# EAGLE design Duino232 (EAGLE 4.16)
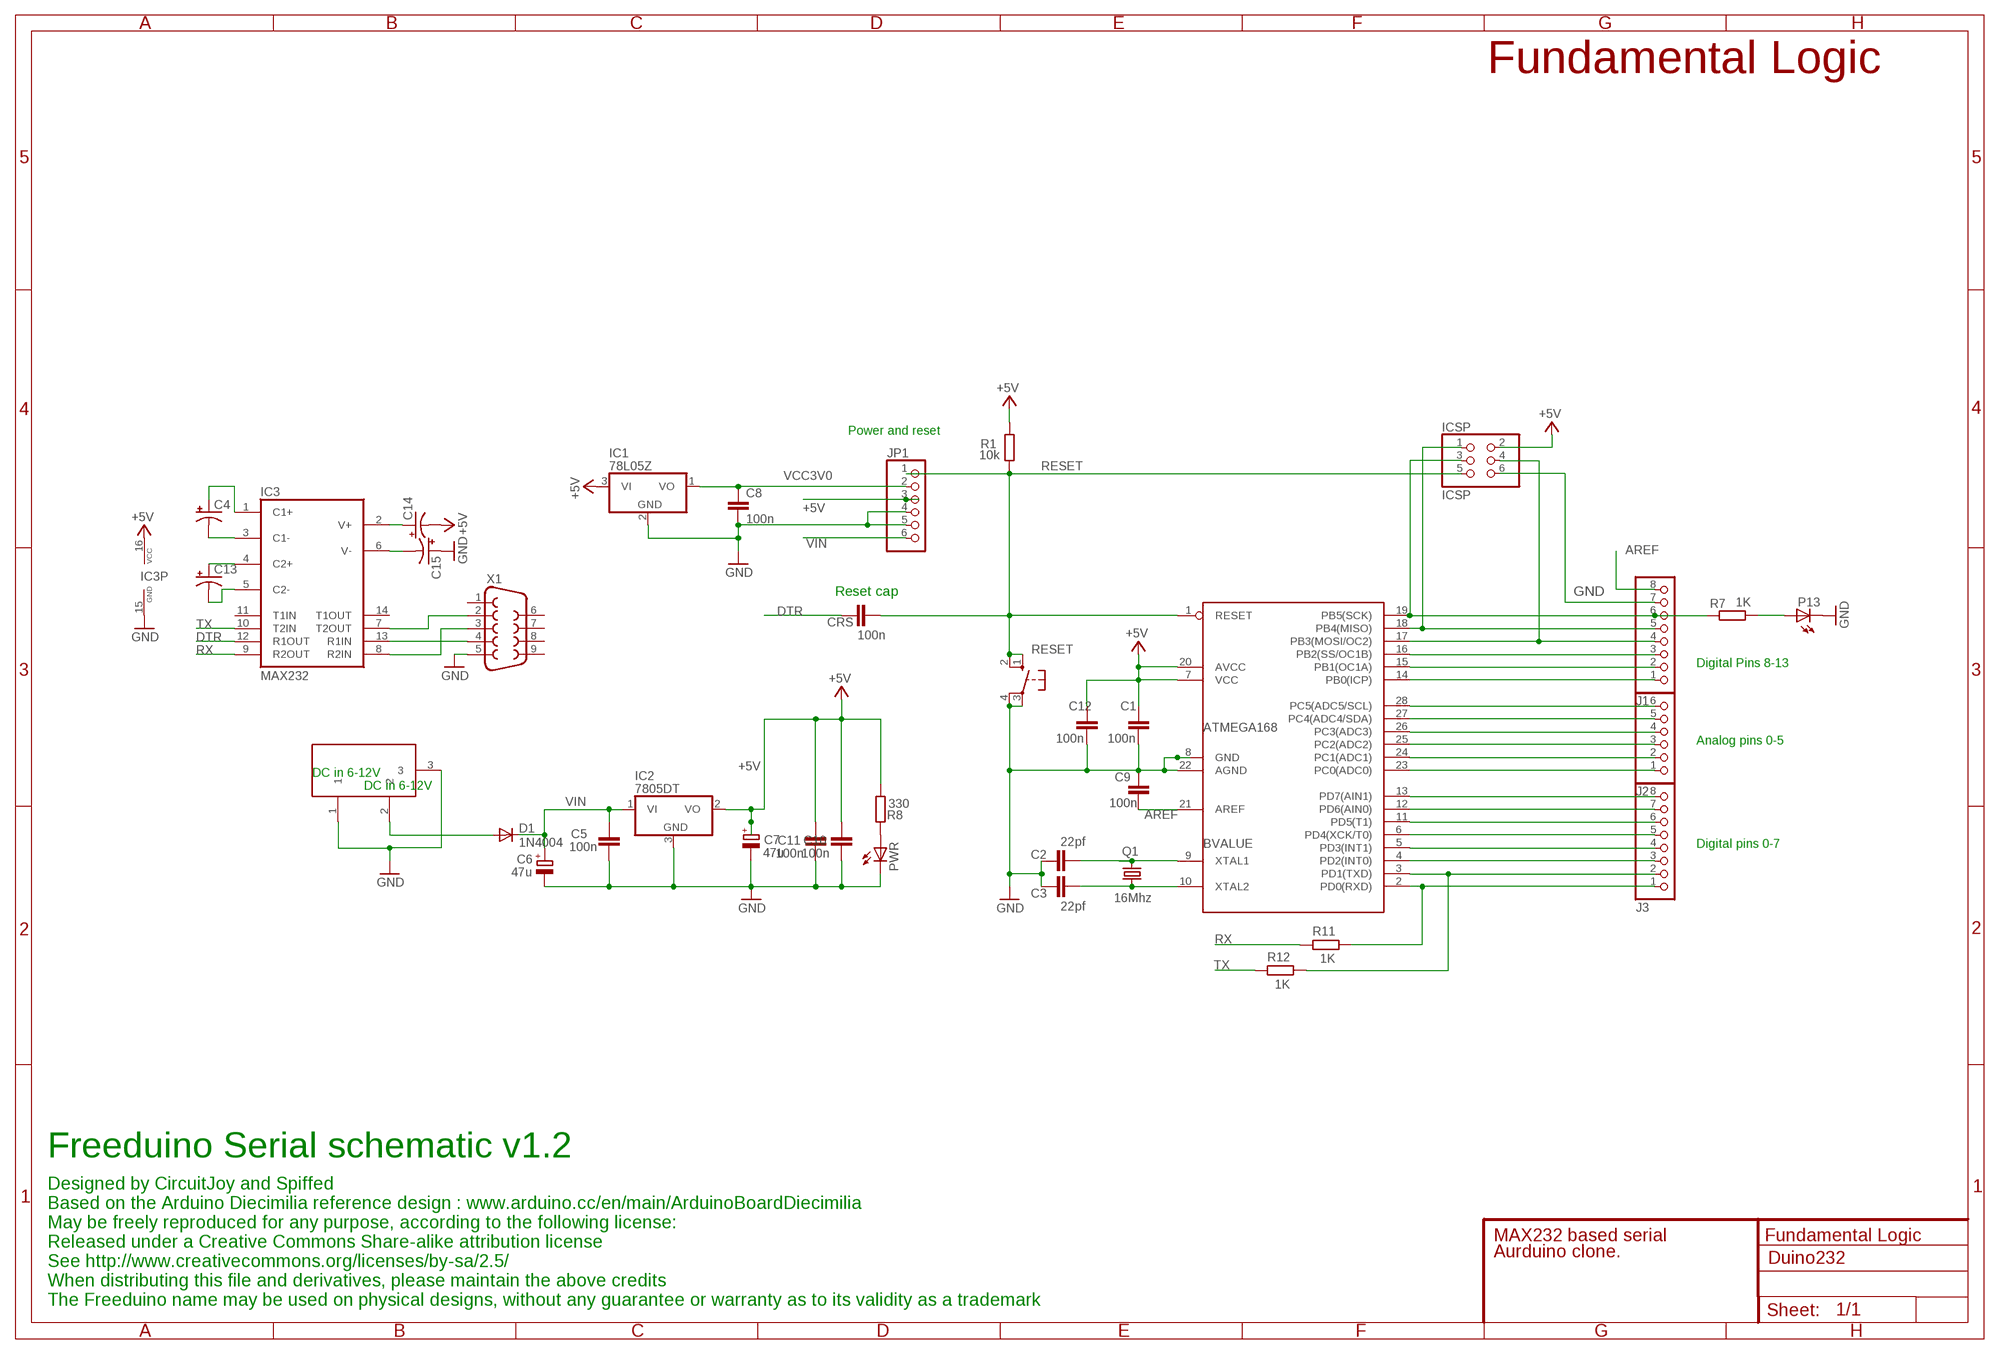
[diagram p0: schematic, sheet 1]

## Parts
BVALUE  ATMEGA168  MEGA8-P  [DIL28-3]
C1  100n  C-EU050-024X044  [C050-024X044]
C2  22pf  C-EU025-024X044  [C025-024X044]
C3  22pf  C-EU025-024X044  [C025-024X044]
C4  CPOL-USE1.8-4  [E1,8-4]
C5  100n  C-EU050-024X044  [C050-024X044]
C6  47u  CPOL-EUE3.5-8  [E3,5-8]
C7  47u  CPOL-EUE3.5-8  [E3,5-8]
C8  100n  C-EU050-024X044  [C050-024X044]
C9  100n  C-EU050-024X044  [C050-024X044]
C10  100n  C-EU050-024X044  [C050-024X044]
C11  100n  C-EUC1206  [C1206]
C12  100n  C-EU050-024X044  [C050-024X044]
C13  CPOL-USE1.8-4  [E1,8-4]
C14  CPOL-USE1.8-4  [E1,8-4]
C15  CPOL-USE1.8-4  [E1,8-4]
CRS  100n  C-EU050-024X044  [C050-024X044]
D1  1N4004  [DO41-10]
DC1  9V in  DC21MMX  [DC-21MM]
IC1  78L05Z  [TO92]
IC2  7805DT  [TO252]
IC3  MAX232  [DIL16]
ICSP  ICSP  PINHD-2X3  [2X03]
J1  PINHD-1X8  [1X08]
J2  PINHD-1X6  [1X06]
J3  PINHD-1X8  [1X08]
JP1  PINHD-1X6  [1X06]
P13  LED3MM  [LED3MM]
PWR  LED3MM  [LED3MM]
Q1  16Mhz  CRYSTALHC49U-V  [HC49U-V]
R1  10k  R-EU_0204/7  [0204/7]
R7  1K  R-EU_0204/7  [0204/7]
R8  330  R-EU_0204/7  [0204/7]
R11  1K  R-EU_0204/7  [0204/7]
R12  1K  R-EU_0204/7  [0204/7]
RESET  10-XX  [B3F-10XX]
X1  F09HP  [F09HP]

## Nets
+5V [power]: BVALUE.7(VCC) BVALUE.20(AVCC) C1.1 C7.+ C10.2 C11.2 C12.1 C14.- IC1.3(VI) IC2.2(VO) IC3.16(VCC) ICSP.2 JP1.3 R1.2 R8.1
AREF: BVALUE.21(AREF) C9.1 J1.8
DTR: CRS.1 IC3.12(R1OUT)
GND [power]: BVALUE.8(GND) BVALUE.22(AGND) C1.2 C2.1 C3.1 C5.1 C6.- C7.- C8.2 C9.2 C10.1 C11.1 C12.2 C15.+ DC1.1 DC1.3 IC1.2(GND) IC2.3(GND) IC3.15(GND) ICSP.6 J1.7 JP1.4 JP1.5 P13.K(C) PWR.K(C) RESET.3(P) RESET.4(P1) X1.5
N$2: BVALUE.15(PB1(OC1A)) J1.2
N$3: PWR.A R8.2
N$6: BVALUE.9(XTAL1) C2.2 Q1.2
N$7: C14.+ IC3.2(V+)
N$8 [power]: D1.A DC1.2
N$9: C15.- IC3.6(V-)
N$10: BVALUE.4(PD2(INT0)) J3.3
N$11: BVALUE.5(PD3(INT1)) J3.4
N$12: BVALUE.6(PD4(XCK/T0)) J3.5
N$13: BVALUE.11(PD5(T1)) J3.6
N$14: BVALUE.12(PD6(AIN0)) J3.7
N$15: BVALUE.13(PD7(AIN1)) J3.8
N$16: BVALUE.23(PC0(ADC0)) J2.1
N$17: BVALUE.24(PC1(ADC1)) J2.2
N$18: BVALUE.25(PC2(ADC2)) J2.3
N$19: BVALUE.26(PC3(ADC3)) J2.4
N$20: BVALUE.27(PC4(ADC4/SDA)) J2.5
N$21: BVALUE.28(PC5(ADC5/SCL)) J2.6
N$22: BVALUE.3(PD1(TXD)) J3.2 R12.2
N$23: BVALUE.16(PB2(SS/OC1B)) J1.3
N$24: C4.- IC3.3(C1-)
N$26: BVALUE.18(PB4(MISO)) ICSP.1 J1.5
N$27: C4.+ IC3.1(C1+)
N$28: BVALUE.14(PB0(ICP)) J1.1
N$31: BVALUE.10(XTAL2) C3.2 Q1.1
N$32: P13.A R7.1
N$35: C13.+ IC3.4(C2+)
N$38: C13.- IC3.5(C2-)
N$39: IC3.7(T2OUT) X1.2
N$40: IC3.8(R2IN) X1.3
N$41: IC3.13(R1IN) X1.4
N$43: BVALUE.17(PB3(MOSI/OC2)) ICSP.4 J1.4
N$44: BVALUE.2(PD0(RXD)) J3.1 R11.2
RESET: BVALUE.1(RESET) CRS.2 ICSP.5 JP1.1 R1.1 RESET.1(S) RESET.2(S1)
RX: IC3.9(R2OUT) R11.1
SCK: BVALUE.19(PB5(SCK)) ICSP.3 J1.6 R7.2
TX: IC3.10(T2IN) R12.1
VCC3V0 [power]: C8.1 IC1.1(VO) JP1.2
VIN [power]: C5.2 C6.+ D1.C IC2.1(VI) JP1.6
Unconnected: IC3.11(T1IN) IC3.14(T1OUT) X1.1 X1.6 X1.7 X1.8 X1.9

## Notes on the sheet
- Fundamental Logic
- Power and reset
- Reset cap
- Digital Pins 8-13
- Analog pins 0-5
- DC in 6-12V
- DC in 6-12V
- Digital pins 0-7
- Freeduino Serial schematic v1.2
- Designed by CircuitJoy and Spiffed
- Based on the Arduino Diecimilia reference design : www.arduino.cc/en/main/ArduinoBoardDiecimilia
- May be freely reproduced for any purpose, according to the following license:
- MAX232 based serial | Fundamental Logic
- Released under a Creative Commons Share-alike attribution license
- Aurduino clone.
- See http://www.creativecommons.org/licenses/by-sa/2.5/
- When distributing this file and derivatives, please maintain the above credits
- The Freeduino name may be used on physical designs, without any guarantee or warranty as to its validity as a trademark

## Library data of the parts
BVALUE = my-library:MEGA8-P: MICROCONTROLLER 8 Kbytes FLASH 1 kbytes SRAM 512 bytes EEPROM USART 4-channel 10 bit ADC 2-channel 8 bit ADC Source: avr.lbr
C1-C3 C5 C8-C12 CRS = rcl:C-EU: CAPACITOR, European symbol
C4 C13-C15 = rcl:CPOL-US: POLARIZED CAPACITOR, American symbol
C6 C7 = rcl:CPOL-EU: POLARIZED CAPACITOR, European symbol
D1 = diode:1N4004: DIODE general purpose rectifier, 1 A
DC1 = powersupply:DC21MM
IC1 = linear:78*: Positive VOLTAGE REGULATOR Source: http://cache.national.com/ds/LM/LM78L05.pdf http://www.fairchildsemi.com/ds/LM/LM7805.pdf
IC2 = spiffie-org:78*: Positive VOLTAGE REGULATOR Source: http://cache.national.com/ds/LM/LM78L05.pdf http://www.fairchildsemi.com/ds/LM/LM7805.pdf
IC3 = maxim:MAX232: RS232 TRANSEIVER
ICSP = pinhead:PINHD-2X3: PIN HEADER
J1 J3 = pinhead:PINHD-1X8: PIN HEADER
J2 JP1 = pinhead:PINHD-1X6: PIN HEADER
P13 PWR = led:LED: LED OSRAM: - CHIPLED LG R971, LG N971, LY N971, LG Q971, LY Q971, LO R971, LY R971 LH N974, LH R974 LS Q976, LO Q976, LY Q976 LO Q996 - Hyper CHIPLED LW Q18S LB Q993, LB Q99A, LB R99A - SideLED LS A670, LO A670, LY A670, LG A670, LP A670 LB A673, LV A673, LT A673, LW A673 LH A674 LY A675 LS A676, LA A676, LO A676, LY A676, LW A676 LS A679, LY A679, LG A679 - Hyper Micro SIDELED® LS Y876, LA Y876, LO Y876, LY Y876 LT Y87S - SmartLED LW L88C, LW L88S LB L89C, LB L89S, LG L890 LS L89K, LO L89K, LY L89K LS L896, LA L896, LO L896, LY L896 - TOPLED LS T670, LO T670, LY T670, LG T670, LP T670 LSG T670, LSP T670, LSY T670, LOP T670, LYG T670 LG T671, LOG T671, LSG T671 LB T673, LV T673, LT T673, LW T673 LH T674 LS T676, LA T676, LO T676, LY T676, LB T676, LH T676, LSB T676, LW T676 LB T67C, LV T67C, LT T67C, LS T67K, LO T67K, LY T67K, LW E67C LS E67B, LA E67B, LO E67B, LY E67B, LB E67C, LV E67C, LT E67C LW T67C LS T679, LY T679, LG T679 LS T770, LO T770, LY T770, LG T770, LP T770 LB T773, LV T773, LT T773, LW T773 LH T774 LS E675, LA E675, LY E675, LS T675 LS T776, LA T776, LO T776, LY T776, LB T776 LHGB T686 LT T68C, LB T68C - Hyper Mini TOPLED® LB M676 - Mini TOPLED Santana® LG M470 LS M47K, LO M47K, LY M47K Source: http://www.osram.convergy.de - LUMILED® LXK2-PW12-R00, LXK2-PW12-S00, LXK2-PW14-U00, LXK2-PW14-V00 LXK2-PM12-R00, LXK2-PM12-S00, LXK2-PM14-U00 LXK2-PE12-Q00, LXK2-PE12-R00, LXK2-PE12-S00, LXK2-PE14-T00, LXK2-PE14-U00 LXK2-PB12-K00, LXK2-PB12-L00, LXK2-PB12-M00, LXK2-PB14-N00, LXK2-PB14-P00, LXK2-PB14-Q00 LXK2-PR12-L00, LXK2-PR12-M00, LXK2-PR14-Q00, LXK2-PR14-R00 LXK2-PD12-Q00, LXK2-PD12-R00, LXK2-PD12-S00 LXK2-PH12-R00, LXK2-PH12-S00 LXK2-PL12-P00, LXK2-PL12-Q00, LXK2-PL12-R00 Source: www.luxeon.com
Q1 = crystal:CRYSTAL: CRYSTAL
R1 R7 R8 R11 R12 = rcl:R-EU_: RESISTOR, European symbol
RESET = switch-omron:10-XX: OMRON SWITCH
X1 = con-subd:F09: SUB-D

## Net classes
0 default: width 0.203 mm, drill 0.203 mm
1 power: width 0.406 mm, drill 0.203 mm
2 finepitch: width 0.203 mm, drill 0.203 mm

## Board
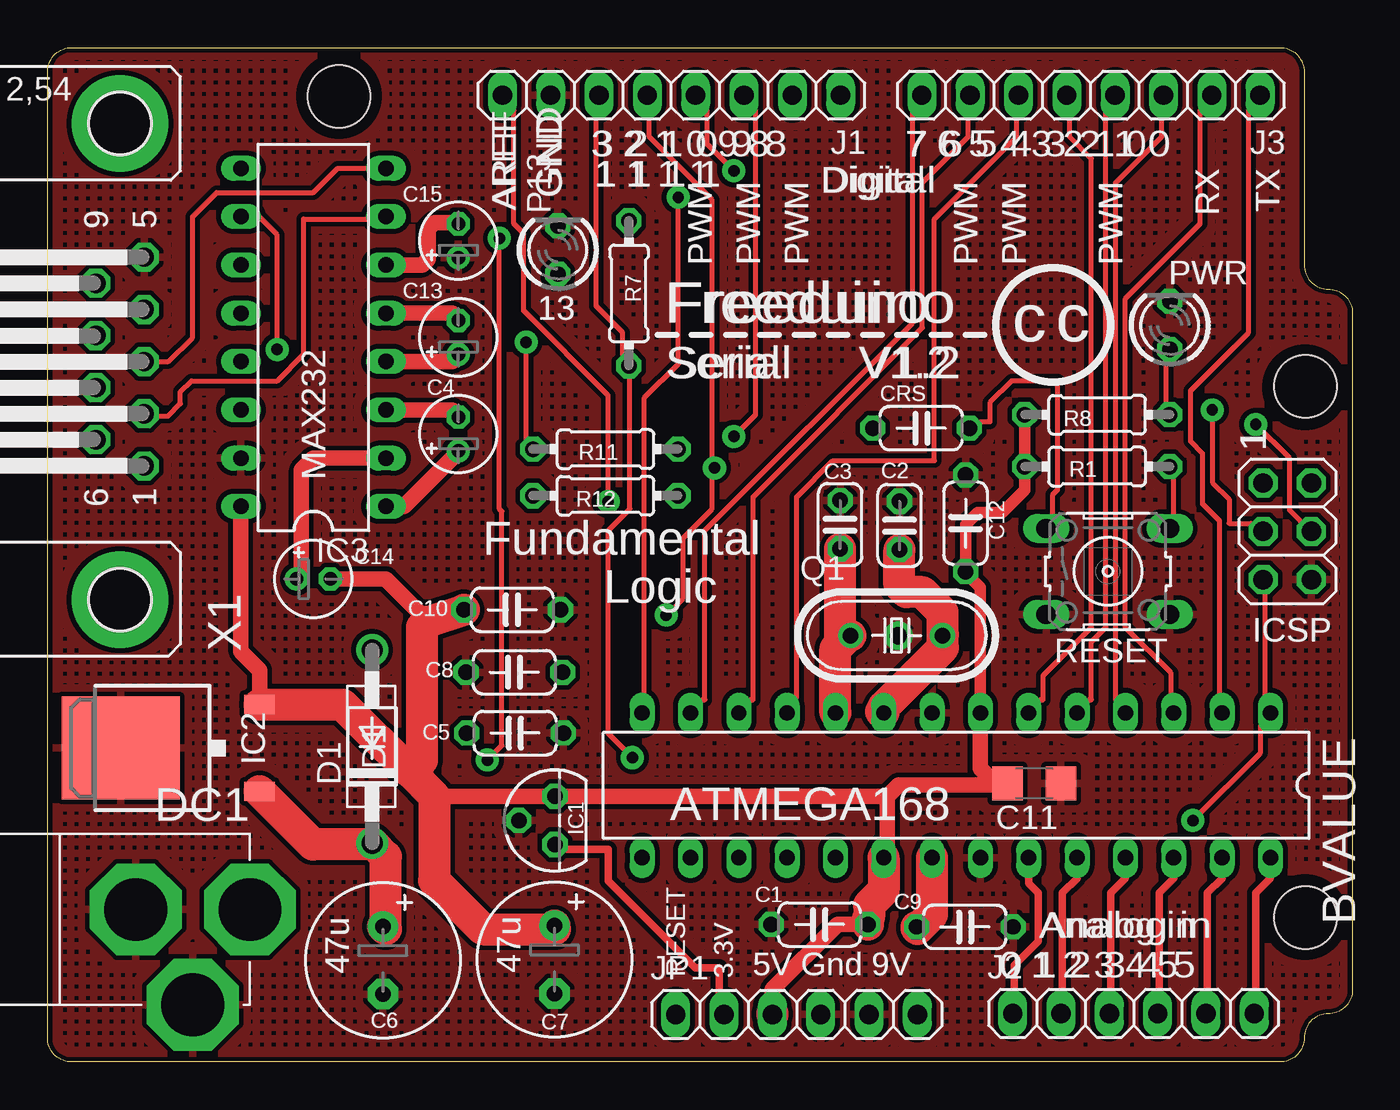
[diagram p1: board, top side]
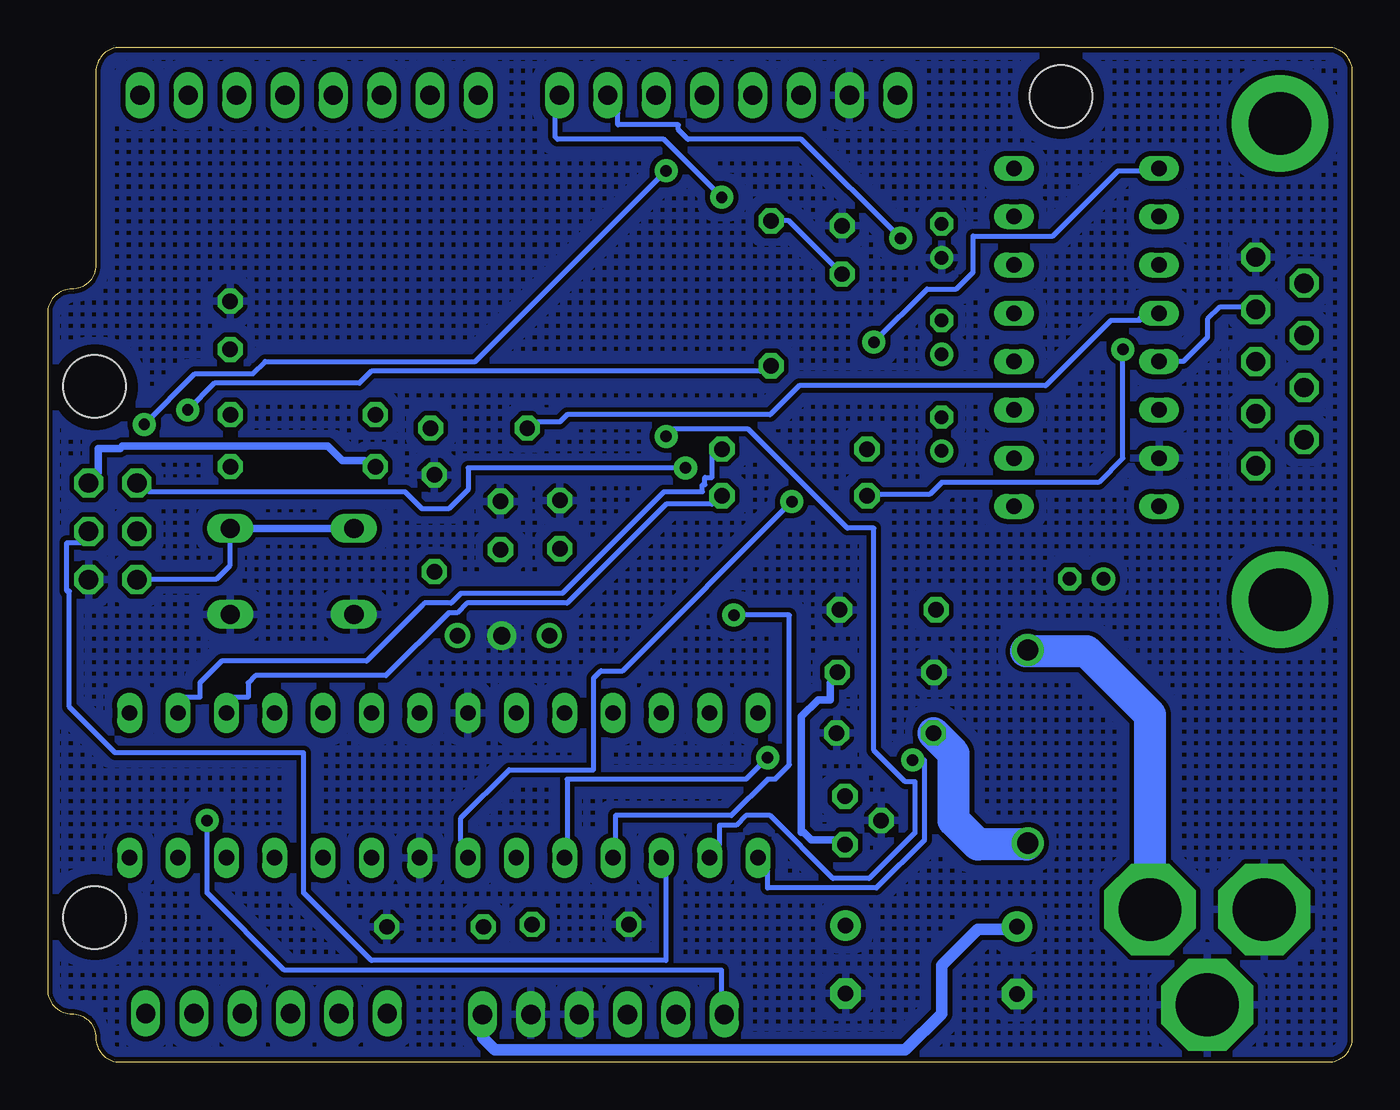
[diagram p2: board, bottom side, seen from below]

Size 68.58 x 53.34 mm. Coordinates in mm from the lower left corner, seen from the top.
Outline: 64.77,53.34 arc-90 66.04,52.07 66.04,41.91 arc90 67.31,40.64 arc-90 68.58,39.37 68.58,3.81 arc-90 67.31,2.54 arc90 66.04,1.27 arc-90 64.77,0 1.27,0 arc-90 0,1.27 0,52.07 arc-90 1.27,53.34 64.77,53.34
Copper layers (1*16): Top 0.035mm / dielectric 1.5mm / Bottom 0.035mm
Design rules "default": minimum track width 10mil, minimum drill 0.6mm, track to track 8mil, track to pad 8mil, pad to pad 8mil, via to via 12mil, smd to smd 8mil, copper to edge 10mil, drill to drill 15mil, minimum pad ring 10mil, minimum via ring 12mil, stop-mask expansion 4mil, vias tented up to drill 0mil, thermal gap 10mil
Holes 3.3 mm at 66.12,35.53 66.12,7.59 15.32,50.77
tRestrict: area 13.4,48.9 to 17.2,52.7; area 64.2,33.6 to 68,37.4; area 64.2,5.7 to 68,9.5
bRestrict: area 13.4,48.9 to 17.2,52.7; area 64.2,33.6 to 68,37.4; area 64.2,5.7 to 68,9.5
vRestrict: area 32.4,38.7 to 49.2,41; area 32.4,35.9 to 40,37.8; area 42.5,35.9 to 47.6,37.8; area 50.2,35.6 to 55.9,41.9; area 22.9,26.7 to 39.4,28.6; area 29.2,24.1 to 36.5,26.7

### Footprints (pad centres in the part's own frame; a part is rotated, then mirrored left to right if it is on the bottom)
DIL28-3 = drill 0.813 long: 1 -16.51,-3.81; 2 -13.97,-3.81; 3 -11.43,-3.81; 4 -8.89,-3.81; 5 -6.35,-3.81; 6 -3.81,-3.81; 7 -1.27,-3.81; 8 1.27,-3.81; 9 3.81,-3.81; 10 6.35,-3.81; 11 8.89,-3.81; 12 11.43,-3.81; 13 13.97,-3.81; 14 16.51,-3.81; 15 16.51,3.81; 16 13.97,3.81; 17 11.43,3.81; 18 8.89,3.81; 19 6.35,3.81; 20 3.81,3.81; 21 1.27,3.81; 22 -1.27,3.81; 23 -3.81,3.81; 24 -6.35,3.81; 25 -8.89,3.81; 26 -11.43,3.81; 27 -13.97,3.81; 28 -16.51,3.81
C050-024X044 = drill 0.813 octagon: 1 -2.54,0; 2 2.54,0
C025-024X044 = drill 0.813 octagon: 1 -1.27,0; 2 1.27,0
E1,8-4 = drill 0.711 pad 1.168 round: + -0.889,0 | drill 0.711 pad 1.168 octagon: - 0.889,0
E3,5-8 = drill 0.813 pad 1.6 round: + -1.778,0 | drill 0.813 pad 1.6 octagon: - 1.778,0
C1206 = smd 1.6 x 1.8: 1 -1.4,0; 2 1.4,0
DO41-10 = drill 1.118 round: A 5.08,0; C -5.08,0
DC-21MM = drill 3.302 pad 4.826 octagon: 1 -5.08,-3.353; 2 -0.076,-6.35; 3 -0.076,-0.356
TO92 = drill 0.813 octagon: 1 -1.27,0; 2 0,1.905; 3 1.27,0
TO252 = smd 1 x 1.6: 1 -2.28,-4.8; 2 2.28,-4.8 | smd 5.4 x 6.2: 3 0,2.5
DIL16 = drill 0.813 long: 1 -8.89,-3.81; 2 -6.35,-3.81; 3 -3.81,-3.81; 4 -1.27,-3.81; 5 1.27,-3.81; 6 3.81,-3.81; 7 6.35,-3.81; 8 8.89,-3.81; 9 8.89,3.81; 10 6.35,3.81; 11 3.81,3.81; 12 1.27,3.81; 13 -1.27,3.81; 14 -3.81,3.81; 15 -6.35,3.81; 16 -8.89,3.81
2X03 = drill 1.016 octagon: 1 -2.54,-1.27; 2 -2.54,1.27; 3 0,-1.27; 4 0,1.27; 5 2.54,-1.27; 6 2.54,1.27
1X08 = drill 1.016 long: 1 -8.89,0; 2 -6.35,0; 3 -3.81,0; 4 -1.27,0; 5 1.27,0; 6 3.81,0; 7 6.35,0; 8 8.89,0
1X06 = drill 1.016 long: 1 -6.35,0; 2 -3.81,0; 3 -1.27,0; 4 1.27,0; 5 3.81,0; 6 6.35,0
LED3MM = drill 0.813 octagon: A -1.27,0; K 1.27,0
HC49U-V = drill 0.813 round: 1 -2.413,0; 2 2.413,0
0204/7 = drill 0.813 octagon: 1 -3.81,0; 2 3.81,0
B3F-10XX = drill 1.016 long: 1 -3.251,2.261; 2 3.251,2.261; 3 -3.251,-2.261; 4 3.251,-2.261
F09HP = drill 1.016 octagon: 1 -5.486,-1.27; 2 -2.743,-1.27; 3 0,-1.27; 4 2.743,-1.27; 5 5.486,-1.27; 6 -4.115,1.27; 7 -1.372,1.27; 8 1.372,1.27; 9 4.115,1.27 | drill 3.302 pad 5.08 round: G1 -12.522,0; G2 12.522,0

### Placement (x,y rotation side)
BVALUE  47.76,14.54 180 top
C1  40.57,7.23 180 top
C2  44.78,28.21 270 top
C3  41.66,28.26 270 top
C4  21.59,33.02 90 top
C5  24.57,17.3 180 top
C6  17.62,5.35 270 top
C7  26.64,5.38 270 top
C8  24.53,20.49 180 top
C9  48.21,7.11 0 top
C10  24.42,23.78 180 top
C11  51.85,14.65 180 top
C12  48.25,28.33 90 top
C13  21.59,38.1 90 top
C14  13.97,25.4 0 top
C15  21.59,43.18 90 top
CRS  45.91,33.33 0 top
D1  17.06,16.59 90 top
DC1  4.28,8.09 90 top
IC1  26.67,12.7 90 top
IC2  6.35,16.51 90 top
IC3  13.97,38.1 90 top
ICSP  65.15,27.9 270 top
J1  32.79,50.84 180 top
J2  57.07,2.55 0 top
J3  54.84,50.84 180 top
JP1  39.36,2.5 0 top
P13  26.82,42.7 90 top
PWR  58.98,38.73 90 top
Q1  44.62,22.43 0 top
R1  55.16,31.31 180 top
R7  30.55,40.42 270 top
R8  55.16,34.03 0 top
R11  29.32,32.23 0 top
R12  29.32,29.77 0 top
RESET  55.73,25.79 0 top
U$3  [CC-LOGO]  53.74,39.37 0 top
X1  3.81,36.83 90 top

### Tracks (layer width: path | path; a pad name or v marks a point on that pad's centre or on a via)
+5V
  Top 0.61: R8.1 51.35,31.51 51.44,31.43 51.35,31.35 R1.2 51.35,30.08 50.16,28.89 48.9,28.89 48.26,28.26 48.26,25.72 48.25,25.73 | 48.25,25.73 C12.1 | C11.2 49.85,14.56 49.85,14.61 | 44.13,10.79 44.07,10.73 BVALUE.20 | BVALUE.7 49.03,24.95 48.25,25.73
  Top 0.813: C1.1 41.52,7.23 38.1,3.81 38.1,2.54 | 49.85,14.56 44.72,14.56 44.13,13.97 | 44.13,13.97 44.13,10.79 | BVALUE.7 49.03,15.43 49.85,14.61 | 44.13,13.97 IC1.3 20.32,13.97 | IC2.2 11.15,20.6 10.16,21.59 IC3.16 | 19.97,23.14 19.97,23.21 17.78,25.4 C14.-
  Top 1.676: IC2.2 15.5,18.79 19.05,15.24 | 19.05,15.24 20.32,13.97 20.32,9.53 22.86,6.99 26.67,6.99 26.64,7.02 C7.+ | C10.2 19.97,23.14 19.68,22.86 19.68,15.88 19.05,15.24 | BVALUE.20 43.95,9.02 43.18,8.26 43.18,7.62 43.11,7.55 C1.1 | 38.1,2.54 38.09,2.54 JP1.3
  Bottom 0.406: ICSP.2 65.91,30.99 65.91,32.26 64.77,32.26 64.64,32.38 53.85,32.38 53.09,31.62 51.94,31.62 R1.2
  Bottom 0.61: C12.1 48.25,25.73
AREF  (via drill 0.6)
  Top 0.254: v29.46,29.46 29.46,35.05 25.02,39.5 25.02,43.56 24.51,44.07 24.51,50.04 J1.8
  Top 1.676: C9.1 45.67,7.03 45.72,6.99 46.49,7.75 BVALUE.21
  Bottom 0.254: v29.46,29.46 38.35,20.57 39.5,20.57 39.88,20.19 39.88,15.37 44.32,15.37 46.86,12.83 46.86,11.68 BVALUE.21
DTR
  Bottom 0.254: IC3.12 11.18,39.12 11.18,38.99 12.7,38.99 16.13,35.56 29.08,35.56 30.61,34.04 41.27,34.04 41.66,33.66 42.8,33.66 CRS.1
GND  (via drill 0.9)
  other vias: 44.7,22.42
  pour Bottom (isolate 0.254, hatched): -1.27,54.61 69.85,54.61 69.85,-1.27 -1.27,-1.27
  pour Top (isolate 0.254, hatched): -1.27,54.61 69.85,54.61 69.85,-1.27 -1.27,-1.27
N$2  (via drill 0.6)
  Top 0.254: v23.11,15.88 23.88,16.64 23.88,28.96 23.75,29.08 v23.75,43.31
  Bottom 0.254: v23.11,15.88 22.48,15.88 22.48,11.68 25.02,9.14 30.73,9.14 30.73,10.03 BVALUE.15 | v23.75,43.31 28.96,48.51 34.92,48.51 35.43,49.02 35.43,49.28 38.61,49.28 38.61,49.91 J1.2
N$3
  Top 0.254: R8.2 58.8,34.67 58.8,36.83 PWR.A
N$6
  Top 1.676: 43.81,18.41 43.88,18.35 BVALUE.9 43.95,18.67 47.05,21.78 47.05,22.48 47.04,22.46 Q1.2 47.04,23.64 45.97,24.7 45.15,24.7 44.77,25.08 44.77,26.92 C2.2
N$7
  Top 0.813: IC3.2 13.97,31.75 13.34,31.11 13.34,25.4 C14.+
N$8
  Bottom 1.676: DC1.2 10.63,18.25 13.97,21.59 17.14,21.59 D1.A
N$9
  Top 0.813: IC3.6 19.68,41.91 20,42.23 20,43.81 20.32,44.13 21.59,44.13 C15.-
N$10
  Top 0.254: BVALUE.4 56.13,19.05 56.13,46.23 58.55,48.64 58.55,49.66 J3.3
N$11
  Top 0.254: BVALUE.5 54.74,19.05 54.86,19.05 54.86,22.1 55.63,22.86 55.63,49.91 J3.4
N$12
  Top 0.254: BVALUE.6 52.2,19.05 52.32,19.05 52.32,20.32 54.86,22.86 54.86,47.5 53.72,48.64 53.72,49.66 J3.5
N$13
  Top 0.254: BVALUE.11 39.37,19.18 39.37,29.72 41.27,31.62 46.61,31.62 46.61,44.32 50.93,48.64 50.93,49.66 J3.6
N$14
  Top 0.254: BVALUE.12 36.96,19.05 37.08,19.05 37.08,29.72 45.97,38.61 45.97,46.23 48.39,48.64 48.39,49.66 J3.7
N$15
  Top 0.254: BVALUE.13 34.42,19.05 34.54,19.05 34.54,27.94 45.47,38.86 45.47,49.91 J3.8
N$16
  Top 0.406: BVALUE.23 51.57,9.39 52.07,8.89 52.07,6.35 50.8,5.08 50.8,2.54 50.79,2.55 J2.1
N$17
  Top 0.406: BVALUE.24 54.11,9.66 53.34,8.89 53.34,2.54 53.33,2.55 J2.2
N$18
  Top 0.406: BVALUE.25 56.65,9.66 55.88,8.89 55.88,2.54 55.87,2.55 J2.3
N$19
  Top 0.406: BVALUE.26 59.19,9.66 58.42,8.89 58.42,2.54 58.41,2.55 J2.4
N$20
  Top 0.406: BVALUE.27 61.73,9.66 60.96,8.89 60.96,2.54 60.95,2.55 J2.5
N$21
  Top 0.406: BVALUE.28 64.27,9.66 63.5,8.89 63.5,2.54 63.49,2.55 J2.6
N$22
  Top 0.254: J3.2 60.58,50.04 60.58,44.07 56.64,40.13 56.64,22.86 59.05,20.45 59.05,19.3 BVALUE.3
  Bottom 0.254: R12.2 33.66,29.46 33.66,29.34 36.07,29.34 41.27,24.13 46.55,24.13 47.05,23.62 47.5,23.62 50.8,20.32 57.66,20.32 58.04,19.94 58.04,19.18 58.8,19.18 BVALUE.3
N$23  (via drill 0.6)
  Top 0.254: v36.07,32.89 37.21,34.04 37.21,50.04 J1.3
  Bottom 0.254: v36.07,32.89 35.69,33.27 31.75,33.27 26.54,28.07 25.15,28.07 25.15,16.38 23.5,14.73 22.99,14.73 22.99,12.06 25.4,9.65 27.3,9.65 30.61,12.95 31.88,12.95 32.38,12.45 33.27,12.45 33.27,11.43 BVALUE.16
N$24
  Top 0.813: C4.- 21.59,33.97 21.27,34.29 IC3.3
N$26  (via drill 0.6)
  Top 0.254: v32.51,23.5 33.4,24.38 33.4,27.56 34.92,29.08 34.92,31.24 | 34.92,31.24 34.92,45.34 31.62,48.64 31.62,49.66 J1.5 | 34.92,31.24 v35.05,31.24
  Bottom 0.254: v32.51,23.5 29.59,23.5 29.59,15.62 30.35,14.86 30.73,14.86 32.64,12.95 38.73,12.95 38.73,11.68 BVALUE.18 | v35.05,31.24 46.48,31.24 46.48,30.1 47.5,29.08 48.9,29.08 49.78,29.97 63.25,29.97 63.25,30.1 ICSP.1
N$27
  Top 0.813: C4.+ 21.59,32.07 18.73,29.21 IC3.1
N$28  (via drill 0.6)
  Top 0.254: v33.15,45.47 33.15,36.7 31.37,34.92 31.37,19.3 BVALUE.14
  Bottom 0.254: v33.15,45.47 36.2,48.51 41.78,48.51 41.91,48.64 41.91,49.66 J1.1
N$31
  Top 1.676: BVALUE.10 41.41,21.72 41.91,22.23 | 41.91,22.23 42.11,22.43 Q1.1 | C3.2 41.66,22.48 41.91,22.23
N$32
  Bottom 0.254: P13.A | R7.1 29.62,44.23 P13.A
N$35
  Top 0.813: C13.+ 21.59,37.15 21.27,36.83 IC3.4
N$38
  Top 0.813: C13.- 21.59,39.05 21.27,39.37 IC3.5
N$39
  Top 0.254: IC3.7 16.76,44.32 13.46,44.32 13.46,37.21 12.06,35.81 7.56,35.81 6.99,35.24 6.99,34.61 6.35,33.97 5.4,33.97 5.28,34.09 X1.2
N$40
  Top 0.254: IC3.8 15.24,46.99 13.97,45.72 8.89,45.72 7.62,44.45 7.62,38.1 6.35,36.83 X1.3
N$41
  Bottom 0.254: IC3.13 8.89,36.83 7.62,38.1 7.62,39.05 6.99,39.69 5.4,39.69 5.28,39.57 X1.4
N$43  (via drill 0.6)
  Top 0.254: v36.07,46.86 34.67,48.26 34.67,50.04 J1.4 | v63.5,33.53 65.28,31.75 65.28,29.02 66.4,27.9 ICSP.4
  Bottom 0.254: BVALUE.17 36.07,9.78 36.07,5.33 51.56,5.33 55.12,8.89 55.12,16.26 65.02,16.26 67.44,18.67 67.44,24.77 67.56,24.77 67.56,27.3 66.8,27.3 ICSP.4 | v36.07,46.86 46.1,36.83 57.15,36.83 57.78,36.2 60.83,36.2 v63.5,33.53
N$44
  Top 0.254: J3.1 63.12,50.04 63.12,38.35 60.07,35.31 60.07,32.64 60.71,32 60.71,29.34 61.59,28.45 61.59,19.3 BVALUE.2
  Bottom 0.254: R11.2 33.66,31.88 33.66,30.73 34.04,30.73 34.04,30.35 34.16,30.35 34.16,29.97 36.2,29.97 41.53,24.64 46.86,24.64 47.37,24.13 48.77,24.13 48.9,24 | BVALUE.2 61.34,19.18 60.58,19.18 60.58,19.94 59.44,21.08 51.82,21.08 48.9,24 | 48.9,24
RESET  (via drill 0.6)
  Top 0.254: CRS.2 49.02,33.66 49.53,33.66 49.53,34.67 50.67,35.81 53.09,35.81 53.09,30.1 52.83,29.84 52.83,28.7 RESET.1 | R1.1 59.18,30.73 59.18,28.7 RESET.2 | ICSP.5 64.01,24.64 64.01,19.3 BVALUE.1 63.75,17.65 63.75,16.26 v60.2,12.7
  Bottom 0.254: v60.2,12.7 60.2,8.89 56.13,4.83 33.15,4.83 33.15,3.68 JP1.1 | RESET.2 58.98,26.11 59.69,25.4 63.5,25.4 63.54,25.36 ICSP.5
  Bottom 0.406: RESET.1 52.59,28.05 52.7,27.94 52.82,28.05 RESET.2
RX  (via drill 0.6)
  Top 0.254: v25.15,37.85 25.15,32.77 R11.1
  Bottom 0.254: v25.15,37.85 22.35,40.64 20.83,40.64 19.94,41.53 19.94,43.43 15.75,43.43 12.32,46.86 11.18,46.86 IC3.9
SCK  (via drill 0.6)
  Top 0.254: v30.73,16 29.46,17.27 29.46,27.94 30.61,29.08 30.61,36.07 R7.2 30.23,37.21 30.23,38.35 28.83,39.75 28.83,49.66 J1.6 | v61.21,34.29 61.21,30.48 62.1,29.59 62.1,28.32 63.25,28.32 ICSP.3
  Bottom 0.254: v30.73,16 31.88,14.86 41.27,14.86 41.27,11.68 BVALUE.19 | v61.21,34.29 59.82,35.69 52.2,35.69 51.56,36.32 31.11,36.32 R7.2
TX  (via drill 0.6)
  Top 0.254: IC3.10 11.11,44.45 12.06,43.5 v12.06,37.47
  Bottom 0.254: v12.06,37.47 12.06,31.75 13.34,30.48 21.59,30.48 22.23,29.84 25.4,29.84 25.51,29.73 | 25.51,29.73 25.72,29.53 | 25.51,29.73 R12.1
VCC3V0
  Top 0.406: IC1.1 27.3,11.18 29.46,11.18 29.46,9.53 34.04,4.95 35.31,4.95 35.31,3.68 JP1.2
  Bottom 0.406: C8.1 27.43,19.94 27.43,19.05 28.07,19.05 28.96,18.16 28.96,12.06 28.83,12.06 28.45,11.68 27.3,11.68 IC1.1
VIN
  Top 1.676: 17.14,11.43 | 17.14,11.43 D1.C | IC2.1 13.95,11.43 17.14,11.43 | C6.+ 17.76,6.99 17.78,6.99 17.78,10.79 17.14,11.43
  Bottom 0.61: JP1.6 45.72,1.26 45.09,0.64 23.5,0.64 21.59,2.54 21.59,5.08 19.68,6.99 17.78,6.99
  Bottom 0.813: 17.78,6.99 17.64,7.12 C6.+
  Bottom 1.676: C5.2 20.95,16.22 20.95,12.7 19.68,11.43 17.14,11.43 D1.C

### Text on the board
tPlace: 3 2 1 0 9 8 | 7 6 5 4 3 2 1 0 | RX | TX | 1 1 1 1 | Digital | AREF | GND | PWM | PWM | PWM | PWM | PWM | PWM | 13 | Freeduino | Serial | V1.2 | 1 | Fundamental | Logic | Analog in | 5V Gnd 9V | RESET | 3.3V | 0 1 2 3 4 5
Edit History: 20070917 WestfW: Move (CC) symbol, use silk_gen to get 5mil widths | 20070917 WestfW: Manual route some, autoroute rest. Fiddle. | 20070917 WestfW: Now V1.16. Change components to TH. | 20070911 WestfW: Now V1.15. Move tracks slightly for shielding | 20070900 Daniel: Schematic and initial placement
_tsilk: 3 2 1 0 9 8 | 7 6 5 4 3 2 1 0 | RX | TX | 1 1 1 1 | Digital | C15 | AREF | GND | 9 | 5 | PWM | PWM | PWM | PWM | PWM | PWM | PWR | C13 | R7 | 13 | Freeduino | c | c | Serial | V1.2 | C4 | CRS | R8 | R11 | 1 | MAX232 | C3 | C2 | R1 | C12 | 6 | 1 | R12 | Fundamental | C14 | C10 | Logic | ICSP | RESET | C8 | IC2 | D1 | C5 | ATMEGA168 | IC1 | C1 | C9 | 47u | 47u | Analog in | 5V Gnd 9V | RESET | 3.3V | 0 1 2 3 4 5 | C6 | C7